# Altium schematic sheet microcontroller_cortexM3.SchDoc: Cortex M3 Microcontroller
size 419 x 297 mm; Address6: Project_Address6; CompanyName: NOT USED; DocumentNumber: 22; SheetNumber: 22; SheetTotal: 22; PageSetup: Record=PageOptions|CenterHorizontal=True|CenterVertical=True|PrintScale=1.00|XCorrection=1.00|YCorrection=1.00|PrintKind=0|BorderSize=5000000|LeftOffset=0|BottomOffset=0|Orientation=2|PaperLength=1000|PaperWidth=1000|Scale=100|PaperSource=7|PrintQuality=-4|MediaType=1|DitherType=10|PaperKind=A3|PrintScaleMode=0
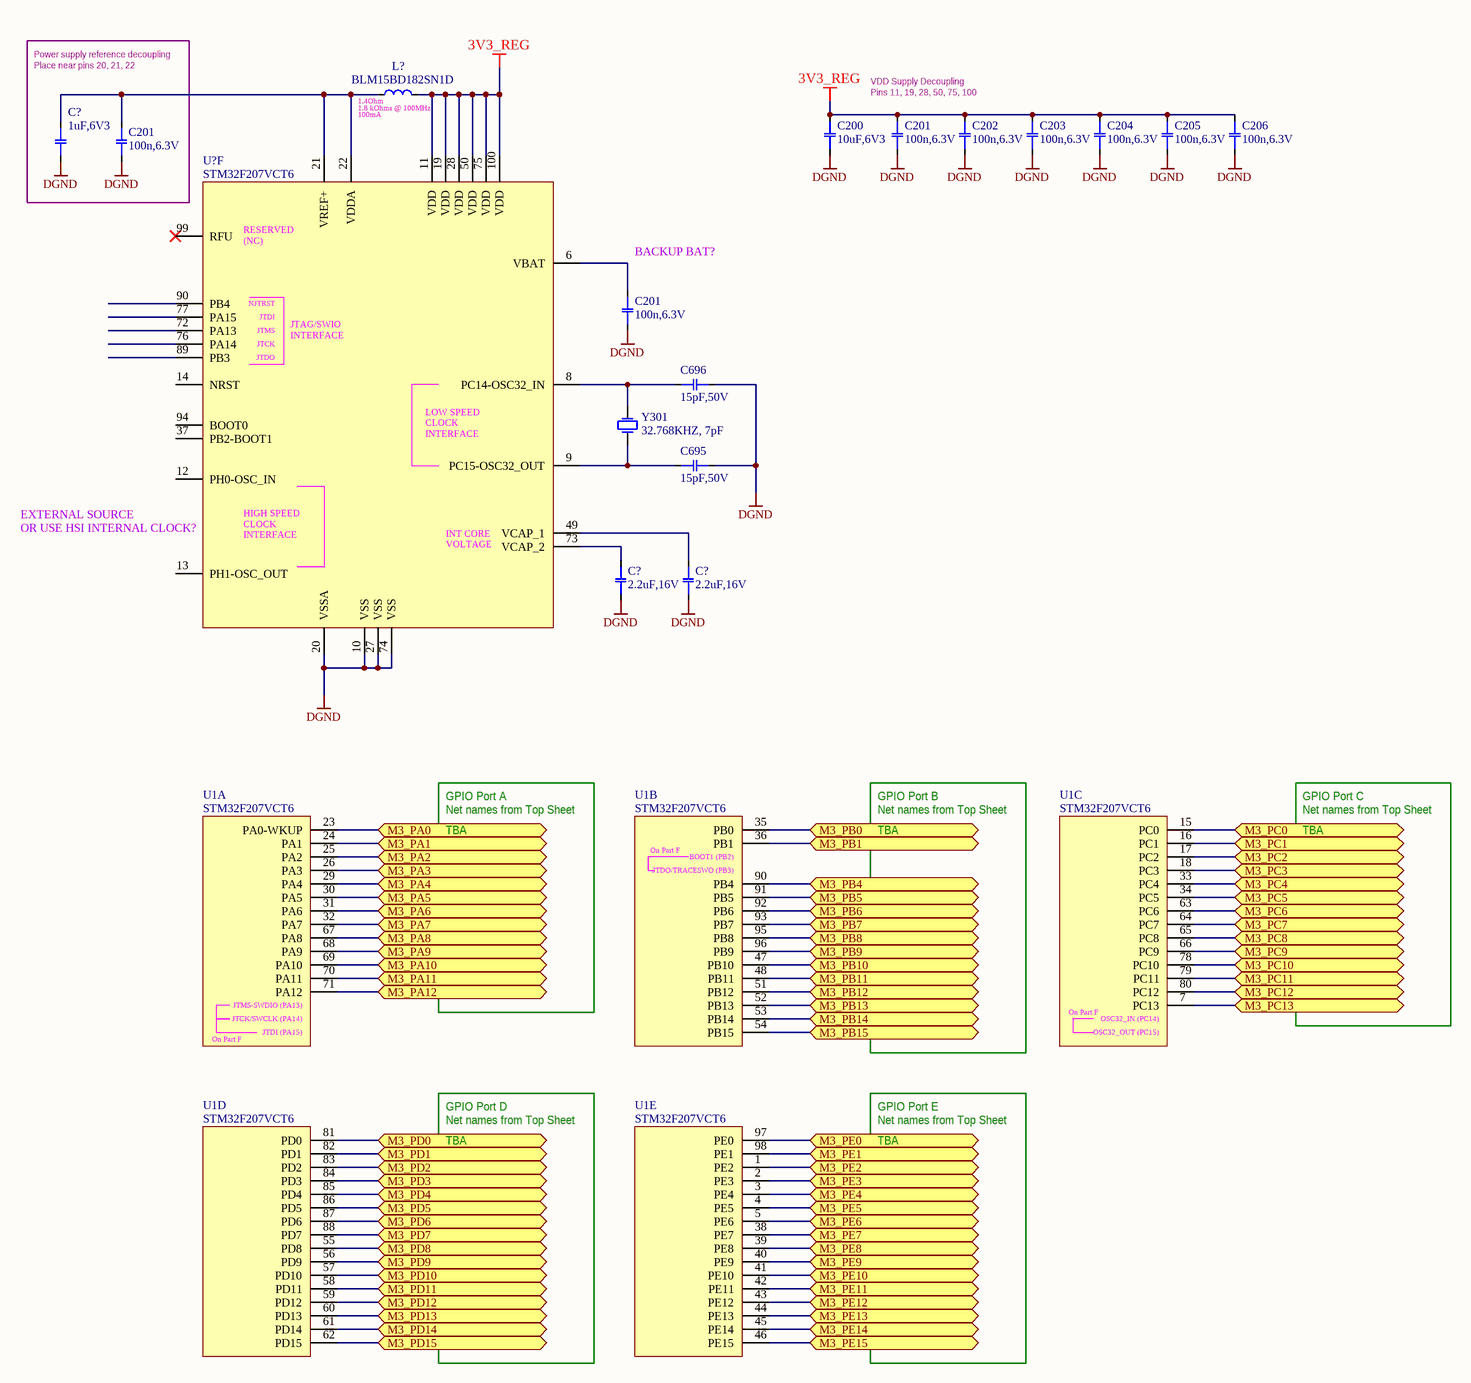
[diagram p0: microcontroller_cortexM3.SchDoc]

## Parts
(Parts that share a designator on the sheet are numbered #1, #2 ... from top to bottom, then left to right.)
C200  10uF,6V3  [CAPC1608X10N_0603]
C201#1  100n,6.3V  [CAPC0603X03L_0201]
C201#2  100n,6.3V  [CAPC0603X03L_0201]
C201#3  100n,6.3V  [CAPC0603X03L_0201]
C202  100n,6.3V  [CAPC0603X03L_0201]
C203  100n,6.3V  [CAPC0603X03L_0201]
C204  100n,6.3V  [CAPC0603X03L_0201]
C205  100n,6.3V  [CAPC0603X03L_0201]
C206  100n,6.3V  [CAPC0603X03L_0201]
C695  15pF,50V  [CAPC1005X05N_0402]
C696  15pF,50V  [CAPC1005X05N_0402]
C?#1  1uF,6V3  [CAPC1005X06N_0402]
C?#2  2.2uF,16V  [CAPC1005X06N_0402]
C?#3  2.2uF,16V  [CAPC1005X06N_0402]
L?  BLM15BD182SN1D  Current Rating: 100mA  DC Resistance: 1.4Ohm  Impedance @ Frequency: 1.8 kOhms @ 100MHz  [INDC1005X06N_0402]
U1  STM32F207VCT6  [LQFP50P1600X1600X160-100N]  (parts A,B,C,D,E of 6)
U?  STM32F207VCT6  [LQFP50P1600X1600X160-100N]  (part F of 6)
Y301  32.768KHZ, 7pF  [XTAL_ABS07]

## Ports
M3_PA0 (bidir), M3_PA1 (bidir), M3_PA2 (bidir), M3_PA3 (bidir), M3_PA4 (bidir), M3_PA5 (bidir), M3_PA6 (bidir), M3_PA7 (bidir), M3_PA8 (bidir), M3_PA9 (bidir), M3_PA10 (bidir), M3_PA11 (bidir), M3_PA12 (bidir), M3_PB0 (bidir), M3_PB1 (bidir), M3_PB4 (bidir), M3_PB5 (bidir), M3_PB6 (bidir), M3_PB7 (bidir), M3_PB8 (bidir), M3_PB9 (bidir), M3_PB10 (bidir), M3_PB11 (bidir), M3_PB12 (bidir), M3_PB13 (bidir), M3_PB14 (bidir), M3_PB15 (bidir), M3_PC0 (bidir), M3_PC1 (bidir), M3_PC2 (bidir), M3_PC3 (bidir), M3_PC4 (bidir), M3_PC5 (bidir), M3_PC6 (bidir), M3_PC7 (bidir), M3_PC8 (bidir), M3_PC9 (bidir), M3_PC10 (bidir), M3_PC11 (bidir), M3_PC12 (bidir), M3_PC13 (bidir), M3_PD0 (bidir), M3_PD1 (bidir), M3_PD2 (bidir), M3_PD3 (bidir), M3_PD4 (bidir), M3_PD5 (bidir), M3_PD6 (bidir), M3_PD7 (bidir), M3_PD8 (bidir), M3_PD9 (bidir), M3_PD10 (bidir), M3_PD11 (bidir), M3_PD12 (bidir), M3_PD13 (bidir), M3_PD14 (bidir), M3_PD15 (bidir), M3_PE0 (bidir), M3_PE1 (bidir), M3_PE2 (bidir), M3_PE3 (bidir), M3_PE4 (bidir), M3_PE5 (bidir), M3_PE6 (bidir), M3_PE7 (bidir), M3_PE8 (bidir), M3_PE9 (bidir), M3_PE10 (bidir), M3_PE11 (bidir), M3_PE12 (bidir), M3_PE13 (bidir), M3_PE14 (bidir), M3_PE15 (bidir)

## Nets
3V3_REG: C200.2 C201#1.2 C202.2 C203.2 C204.2 C205.2 C206.2 L?.2 U?.11(VDD) U?.19(VDD) U?.28(VDD) U?.50(VDD) U?.75(VDD) U?.100(VDD)
DGND: C200.1 C201#1.1 C201#2.1 C201#3.1 C202.1 C203.1 C204.1 C205.1 C206.1 C695.1 C696.1 C?#1.1 C?#2.1 C?#3.1 U?.10(VSS) U?.20(VSSA) U?.27(VSS) U?.74(VSS)
M3_PA0: U1.23(PA0-WKUP) ; port M3_PA0
M3_PA1: U1.24(PA1) ; port M3_PA1
M3_PA2: U1.25(PA2) ; port M3_PA2
M3_PA3: U1.26(PA3) ; port M3_PA3
M3_PA4: U1.29(PA4) ; port M3_PA4
M3_PA5: U1.30(PA5) ; port M3_PA5
M3_PA6: U1.31(PA6) ; port M3_PA6
M3_PA7: U1.32(PA7) ; port M3_PA7
M3_PA8: U1.67(PA8) ; port M3_PA8
M3_PA9: U1.68(PA9) ; port M3_PA9
M3_PA10: U1.69(PA10) ; port M3_PA10
M3_PA11: U1.70(PA11) ; port M3_PA11
M3_PA12: U1.71(PA12) ; port M3_PA12
M3_PB0: U1.35(PB0) ; port M3_PB0
M3_PB1: U1.36(PB1) ; port M3_PB1
M3_PB4: U1.90(PB4) ; port M3_PB4
M3_PB5: U1.91(PB5) ; port M3_PB5
M3_PB6: U1.92(PB6) ; port M3_PB6
M3_PB7: U1.93(PB7) ; port M3_PB7
M3_PB8: U1.95(PB8) ; port M3_PB8
M3_PB9: U1.96(PB9) ; port M3_PB9
M3_PB10: U1.47(PB10) ; port M3_PB10
M3_PB11: U1.48(PB11) ; port M3_PB11
M3_PB12: U1.51(PB12) ; port M3_PB12
M3_PB13: U1.52(PB13) ; port M3_PB13
M3_PB14: U1.53(PB14) ; port M3_PB14
M3_PB15: U1.54(PB15) ; port M3_PB15
M3_PC0: U1.15(PC0) ; port M3_PC0
M3_PC1: U1.16(PC1) ; port M3_PC1
M3_PC2: U1.17(PC2) ; port M3_PC2
M3_PC3: U1.18(PC3) ; port M3_PC3
M3_PC4: U1.33(PC4) ; port M3_PC4
M3_PC5: U1.34(PC5) ; port M3_PC5
M3_PC6: U1.63(PC6) ; port M3_PC6
M3_PC7: U1.64(PC7) ; port M3_PC7
M3_PC8: U1.65(PC8) ; port M3_PC8
M3_PC9: U1.66(PC9) ; port M3_PC9
M3_PC10: U1.78(PC10) ; port M3_PC10
M3_PC11: U1.79(PC11) ; port M3_PC11
M3_PC12: U1.80(PC12) ; port M3_PC12
M3_PC13: U1.7(PC13) ; port M3_PC13
M3_PD0: U1.81(PD0) ; port M3_PD0
M3_PD1: U1.82(PD1) ; port M3_PD1
M3_PD2: U1.83(PD2) ; port M3_PD2
M3_PD3: U1.84(PD3) ; port M3_PD3
M3_PD4: U1.85(PD4) ; port M3_PD4
M3_PD5: U1.86(PD5) ; port M3_PD5
M3_PD6: U1.87(PD6) ; port M3_PD6
M3_PD7: U1.88(PD7) ; port M3_PD7
M3_PD8: U1.55(PD8) ; port M3_PD8
M3_PD9: U1.56(PD9) ; port M3_PD9
M3_PD10: U1.57(PD10) ; port M3_PD10
M3_PD11: U1.58(PD11) ; port M3_PD11
M3_PD12: U1.59(PD12) ; port M3_PD12
M3_PD13: U1.60(PD13) ; port M3_PD13
M3_PD14: U1.61(PD14) ; port M3_PD14
M3_PD15: U1.62(PD15) ; port M3_PD15
M3_PE0: U1.97(PE0) ; port M3_PE0
M3_PE1: U1.98(PE1) ; port M3_PE1
M3_PE2: U1.1(PE2) ; port M3_PE2
M3_PE3: U1.2(PE3) ; port M3_PE3
M3_PE4: U1.3(PE4) ; port M3_PE4
M3_PE5: U1.4(PE5) ; port M3_PE5
M3_PE6: U1.5(PE6) ; port M3_PE6
M3_PE7: U1.38(PE7) ; port M3_PE7
M3_PE8: U1.39(PE8) ; port M3_PE8
M3_PE9: U1.40(PE9) ; port M3_PE9
M3_PE10: U1.41(PE10) ; port M3_PE10
M3_PE11: U1.42(PE11) ; port M3_PE11
M3_PE12: U1.43(PE12) ; port M3_PE12
M3_PE13: U1.44(PE13) ; port M3_PE13
M3_PE14: U1.45(PE14) ; port M3_PE14
M3_PE15: U1.46(PE15) ; port M3_PE15
NetC201#2_2: C201#2.2 C?#1.2 L?.1 U?.21(VREF+) U?.22(VDDA)
NetC201#3_2: C201#3.2 U?.6(VBAT)
NetC695_2: C695.2 U?.9(PC15-OSC32_OUT) Y301.1
NetC696_2: C696.2 U?.8(PC14-OSC32_IN) Y301.2
NetC?#2_2: C?#2.2 U?.73(VCAP_2)
NetC?#3_2: C?#3.2 U?.49(VCAP_1)

Not connected (* = marked no-connect by the designer): U? 12(PH0-OSC_IN) 13(PH1-OSC_OUT) 14(NRST) 37(PB2-BOOT1) 72(PA13) 76(PA14) 77(PA15) 89(PB3) 90(PB4) 94(BOOT0) 99(RFU)*

## Notes on the sheet
- Power supply reference decoupling
  Place near pins 20, 21, 22
- VDD Supply Decoupling
  Pins 11, 19, 28, 50, 75, 100
- (near C201#3) BACKUP BAT?
- (near U?) EXTERNAL SOURCE
  OR USE HSI INTERNAL CLOCK?
- Net names from Top Sheet
- GPIO Port A
- GPIO Port B
- GPIO Port C
- TBA
- GPIO Port D
- GPIO Port E
- CONFIDENTIAL
- Reproduction, distribution or dissemination of any part of this document without expressed written consent of SmallHD is strictly prohibited.
- Design
- Project
- Drafting
- Layout
- Sheet
- Date
- File
- Checking
- Time
- Variant
- Revision
- of
- Size
- TABLOID
- (in symbol ICT-20168-001, part A) JTMS-SWDIO (PA13); JTCK/SWCLK (PA14); JTDI (PA15); On Part F
- (in symbol ICT-20168-001, part B) On Part F; BOOT1 (PB2); JTDO/TRACESWO (PB3)
- (in symbol ICT-20168-001, part C) On Part F; OSC32_IN (PC14); OSC32_OUT (PC15)
- (in symbol ICT-20168-001, part F) RESERVED (NC); NJTRST; JTDI; JTMS; JTCK; JTAG/SWIO / INTERFACE; JTDO; LOW SPEED / CLOCK INTERFACE /; HIGH SPEED / CLOCK INTERFACE /; INT CORE / VOLTAGE

## Library data of the parts
C200 = CAP-20026-101: CAP CER 10UF 6.3V 20% X5R 0603; Manufacturer: TDK; Manufacturer Part Number: C1608X5R0J106M080AB; Manufacturer-2 Part Number: GRM188R60J106ME47J; Capacitance: 0.1uF; Type: Ceramic; Display_Name: 10uF,6V3; Dielectric: X5R; Tolerance: 20%; Voltage: 6.3V; Manufacturer-2: Murata; Schematic Symbol: CAP-NP_1; smallHD PN: CAP-20026-101
C201#1-C201#3 C202-C206 = CAP-20025-101: CAP CER 0.1UF 6.3V 20% X5R 0201; Manufacturer: TDK; Manufacturer Part Number: C0603X5R0J104M030BC; Manufacturer-2 Part Number: GRM033R60J104ME19D; Type: Ceramic; Display_Name: 100n,6.3V; Capacitance: 0.1uF; Dielectric: X5R; Tolerance: 20%; Voltage: 6.3V; Manufacturer-2: Murata; Schematic Symbol: CAP-NP_1; smallHD PN: CAP-20025-101
C695 C696 = CAP-20029-101: CAP CER 15PF 50V 5% NPO 0402; Manufacturer: Yageo; Manufacturer Part Number: CC0402JRNPO9BN150; Manufacturer-2 Part Number: GRM1555C1E150JA01D; Type: Ceramic; Display Footprint: 0402; Display_Name: 15pF,50V; Capacitance: 15pF; Dielectric: NPO; Tolerance: 5%; Voltage: 50V; Schematic Symbol: CAP-NP_1; Manufacturer-2: Murata; smallHD PN: CAP-20029-101
C?#1 = CAP-20023-101: CAP CER 1UF 6.3V 10% X5R 0402; Manufacturer: AVX; Manufacturer Part Number: 04026D105KAT2A; Manufacturer-2 Part Number: GRM155R60J105KE19D; Capacitance: 1.0uF; Type: Ceramic; Display Footprint: 0402; Display_Name: 1uF,6V3; Dielectric: X5R; Tolerance: 10%; Voltage: 6.3V; Schematic Symbol: CAP-NP_1; smallHD PN: CAP-20023-101; Thickness (Max): 0.56mm; Manufacturer-2: Murata
C?#2 C?#3 = CAP-20053-001: CAP CER 2.2uF 16V X5R 0402; Manufacturer: Murata; Manufacturer Part Number: GRM155R61C225KE11D; Tolerance: 10%; Type: Ceramic; Display Footprint: 0402; Display_Name: 2.2uF,16V; Capacitance: 2.2uF; Dielectric: X5R; Voltage: 16V; Schematic Symbol: CAP-NP_1; smallHD PN: CAP-20053-001; Thickness (Max): 0.55mm
L? = IND-20049-001: FERRITE BEAD 1.8 KOHM 0402 1LN; Manufacturer: Murata; Flex Footprint 1: INDC1005X06N_0402_FLEX; Display Footprint: 0402; Display_Name: BLM15BD182SN1D; Schematic Symbol: INDUCTOR_1; smallHD PN: IND-20049-001; Thickness (Max): 0.55mm; Manufacturer Part Number: BLM15BD182SN1D
U1 U? = ICT-20168-001: IC MCU 32BIT 256KB FLASH 100LQFP; Manufacturer: STMicroelectronics; Temp Range: -40°C ~ 85°C; Display Footprint: 100-LQFP; Display_Name: STM32F207VCT6; smallHD PN: ICT-20168-001; Manufacturer Part Number: STM32F207VCT6
Y301 = XTL-20001-001: CRYSTAL 32.768KHZ 7PF SMD; Manufacturer: Abracon Corporation; Manufacturer Part Number: ABS07-32.768KHZ-7-T; Accuracy: +-20ppm; Frequency: 32768Hz; Display Footprint: ABS07; Display_Name: 32.768KHZ, 7pF; Load Capacitance: 7pF; Schematic Symbol: XTAL_1; smallHD PN: XTL-20001-001